# EasyEDA Pro project Project File.epro

# Schematic Schematic1
Board Name: Board1; Create Date: 2026-05-17; Page Name: P1; Project Name: USB--->TTL; Schematic Name: Schematic1; Update Date: 2026-05-17; Company: EasyEDA.com; Page Size: A4; Version: V1.0
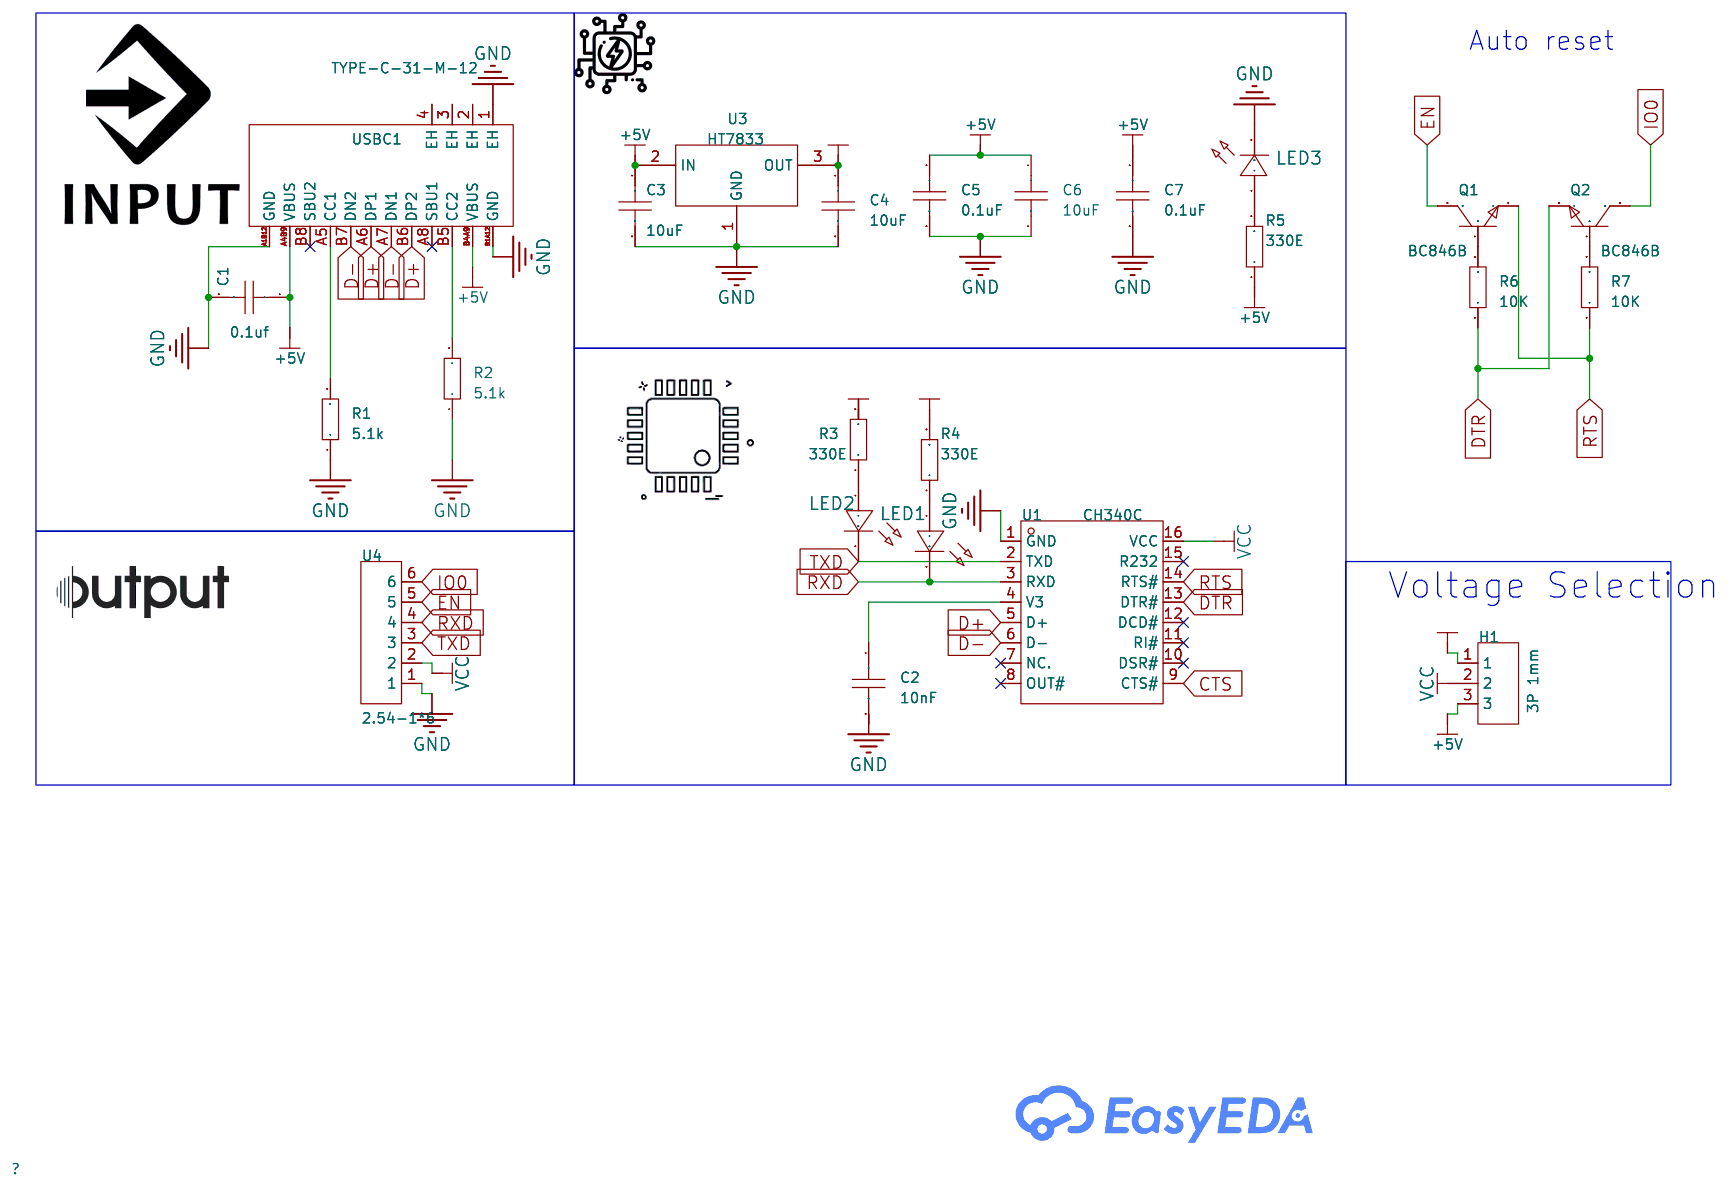
[diagram p0: schematic sheet]

## Parts
C1  0.1uf  [C0805]
C2  10nF  [C0805]
C3  10uF  [C0805]
C4  10uF  [C0805]
C5  0.1uF  [C0805]
C6  10uF  [C0805]
C7  0.1uF  [C0805]
H1  3P 1mm  [HDR-TH_3P-P1.00-V-M]
LED1  -  [LED0805-RD_GREEN_C0805YGC]
LED2  -  [LED0805-RD_GREEN_C0805YGC]
LED3  -  [LED0805-RD_GREEN_C0805YGC]
Q1  BC846B  [SOT-23-3_L2.9-W1.3-P1.90-LS2.4-BR]
Q2  BC846B  [SOT-23-3_L2.9-W1.3-P1.90-LS2.4-BR]
R1  5.1k  [R0805_NEW]
R2  5.1k  [R0805_NEW]
R3  330E  [R0805_NEW]
R4  330E  [R0805_NEW]
R5  330E  [R0805_NEW]
R6  10K  [R0805_NEW]
R7  10K  [R0805_NEW]
U1  CH340C  [SOP-16_L10.0-W3.9-P1.27-LS6.0-BL]
U3  HT7833  [SOT-89_L4.5-W2.5-P1.50-LS4.2-BR]
U4  2.54-1*6  [HDR-TH_6P-P2.54-V-M]
USBC1  TYPE-C-31-M-12  [USB-C_SMD-TYPE-C-31-M-12_1]

## Library data of the parts
C1-C7 = CAP_0603: Supplier Footprint: 0603
H1 = P2C03A-201020-B1P: Pin Structure:1x3P Pitch:1mm Row Spacing:- Circluar Pins/Square Pins:Pin Header Mounting Type:Through Hole Number of Rows:1 Number of Pins:3P Current Rating:750mA Voltage Rating (Max):125V Length of Mating Pin:2mm Insulation Height:1mm Length of End Conne; LCSC Part Name: 1x3P 间距:1mm 方针 直插; Supplier Part: C49005926; Manufacturer: CHIN-BAN(勤本); Supplier Footprint: 插件,P=1mm; JLCPCB Part Class: Extended Part; Datasheet: https://item.szlcsc.com/datasheet/P2C03A-201020-B1P/51356954.html; Supplier: LCSC; Pin Structure: 1x3P; Pitch: 1mm; Circluar Pins/Square Pins: Pin Header; Mounting Type: Through Hole; Number of Rows: 1; Number of Pins: 3P; Current Rating: 750mA; Voltage Rating (Max): 125V; Length of Mating Pin: 2mm; Insulation Height: 1mm; Length of End Connection Pin: 2mm; Contact Material: Copper alloy; Contact Plating: Gold; Operating Temperature: -40℃~+105℃; Color: Black
LED1-LED3 = LED_0402-R: Supplier Footprint: 0402
Q1 Q2 = BC846B_C20069134: type:NPN Current - Collector(Ic):100mA Collector - Emitter Voltage VCEO:65V Pd - Power Dissipation:200mW DC Current Gain:200@2.0mA,5.0V DC Current Gain:200@2.0mA,5.0V Transition frequency(fT):100MHz Current - Collector Cutoff:100nA Vce Saturation(VCE(sat); LCSC Part Name: hFE:200-450，丝印:1B NPN 电流:100mA 电压:65V; Supplier Part: C20069134; Manufacturer: R+O(宏嘉诚); Supplier Footprint: SOT-23; JLCPCB Part Class: Extended Part; Datasheet: https://item.szlcsc.com/datasheet/BC846B/21397172.html; Supplier: LCSC; type: NPN; Current - Collector(Ic): 100mA; Collector - Emitter Voltage VCEO: 65V; Pd - Power Dissipation: 200mW; DC Current Gain: 200@2.0mA,5.0V; Transition frequency(fT): 100MHz; Current - Collector Cutoff: 100nA; Vce Saturation(VCE(sat)): 500mV; Operating Temperature: -55℃~+150℃; Emitter-Base Voltage(Vebo): 6V
R1-R7 = Res_0603: Supplier Footprint: 0603
U1 = CH340C: Applications Function:Transceiver USB Protocol:USB 2.0 Voltage - Supply:3.3V；5V Voltage - Supply:3.3V；5V Data Rate:2Mbps Operating Temperature:-20℃~+70℃ Operating Temperature:-20℃~+70℃ Current - Supply:7mA Supply Current (Iq):50uA; LCSC Part Name: USB转串口芯片; Supplier Part: C84681; Manufacturer: WCH(南京沁恒); Supplier Footprint: SOP-16; JLCPCB Part Class: Extended Part; Datasheet: https://item.szlcsc.com/datasheet/CH340C/85852.html; Supplier: LCSC; Applications Function: Transceiver; USB Protocol: USB 2.0; Voltage - Supply: 3.3V；5V; Data Rate: 2Mbps; Operating Temperature: -20℃~+70℃; Current - Supply: 7mA; Supply Current (Iq): 50uA
U3 = HT7833_C50936: Output Type:Fixed Voltage - Supply:8V Output Voltage:3.3V Output Voltage:3.3V Output Current:500mA Power Supply Rejection Ratio (PSRR):- Voltage Dropout:500mV@(500mA) standby current:7uA Features:Over Current Protection；Over Temperature Protection Operati; LCSC Part Name: 输入8V 输出3.3V 500mA; Supplier Part: C50936; Manufacturer: HOLTEK(合泰/盛群); Supplier Footprint: SOT-89-3; JLCPCB Part Class: Extended Part; Supplier: LCSC; Output Type: Fixed; Voltage - Supply: 8V; Output Voltage: 3.3V; Output Current: 500mA; Voltage Dropout: 500mV@(500mA); standby current: 7uA; Features: Over Current Protection；Over Temperature Protection; Operating Temperature: -40℃~+85℃@(Ta); Output Configuration: Positive; Number of Outputs: 1
U4 = 2.54-1*6: Pin Structure:1x6P Pitch:2.54mm Circluar Pins/Square Pins:Pin Header Mounting Type:Through Hole Number of Rows:1 Number of Pins:6P Current Rating:2.5A Length of Mating Pin:6mm Insulation Height:2.54mm Length of End Connection Pin:3mm Contact Material:Bras; LCSC Part Name: 1x6P 间距:2.54mm 方针 直插; Supplier Part: C5156615; Manufacturer: ZHOURI(洲日); Supplier Footprint: 插件,P=2.54mm; JLCPCB Part Class: Extended Part; Datasheet: https://item.szlcsc.com/datasheet/2.54-1*6/5790715.html; Supplier: LCSC; Pin Structure: 1x6P; Pitch: 2.54mm; Circluar Pins/Square Pins: Pin Header; Mounting Type: Through Hole; Number of Rows: 1; Number of Pins: 6P; Current Rating: 2.5A; Length of Mating Pin: 6mm; Insulation Height: 2.54mm; Length of End Connection Pin: 3mm; Contact Material: Brass; Contact Plating: Gold; Operating Temperature: -40℃~+105℃
USBC1 = TYPE-C-31-M-12: Connector Type:Type-C Protocol Standard:- Gender:Female Mounting Type:Surface Mount, Right Angle Number of Contacts:16P Number of Ports:1 Current Rating-Power:5A Voltage Rating:20V Connect-Disconnect Life:10,000 cycles Length:7.35mm Operating Temperature:; LCSC Part Name: Type-C 母 卧贴; Supplier Part: C165948; Manufacturer: 韩国韩荣; Supplier Footprint: SMD; JLCPCB Part Class: Extended Part; Datasheet: https://item.szlcsc.com/datasheet/TYPE-C-31-M-12/177331.html; Supplier: LCSC; Connector Type: Type-C; Gender: Female; Mounting Type: Surface Mount, Right Angle; Number of Contacts: 16P; Number of Ports: 1; Current Rating-Power: 5A; Voltage Rating: 20V; Connect-Disconnect Life: 10,000 cycles; Length: 7.35mm; Operating Temperature: -30℃~+80℃

## Nets
3.3V: C4.1 H1.1 R3.2 R4.2 U3.3(OUT)
+5V: C1.1 C3.1 C5.1 C6.1 C7.1 H1.3 R5.1 U3.2(IN) USBC1.A4B9(VBUS) USBC1.B4A9(VBUS)
GND: C1.2 C2.2 C3.2 C4.2 C5.2 C6.2 C7.2 LED3.2(C) R1.1 R2.1 U1.1(GND) U3.1(GND) U4.1 USBC1.1(EH) USBC1.A1B12(GND) USBC1.B1A12(GND)
VCC: H1.2 U1.16(VCC) U4.2
CTS: U1.9(CTS#)
D+: U1.5(D+) USBC1.A6(DP1) USBC1.B6(DP2)
D-: U1.6(D-) USBC1.A7(DN1) USBC1.B7(DN2)
DTR: Q2.2(E) R6.1 U1.13(DTR#)
EN: Q1.3(C) U4.5
IO0: Q2.3(C) U4.6
RTS: Q1.2(E) R7.1 U1.14(RTS#)
RXD: LED1.2(C) U1.3(RXD) U4.4
TXD: LED2.2(C) U1.2(TXD) U4.3
$1N550: R1.2 USBC1.A5(CC1)
$1N1145: C2.1 U1.4(V3)
$1N1398: LED2.1(A) R3.1
$1N1424: LED1.1(A) R4.1
$1N1991: LED3.1(A) R5.2
$1N2444: Q1.1(B) R6.2
$1N2534: Q2.1(B) R7.2
$1N4404: R2.2 USBC1.B5(CC2)

Not connected (* = marked no-connect by the designer): U1 7(NC.)* 8(OUT#)* 10(DSR#)* 11(RI#)* 12(DCD#)* 15(R232)*; USBC1 2(EH) 3(EH) 4(EH) A8(SBU1)* B8(SBU2)*

## Notes on the sheet
- Auto reset
- Voltage Selection

# Board PCB1
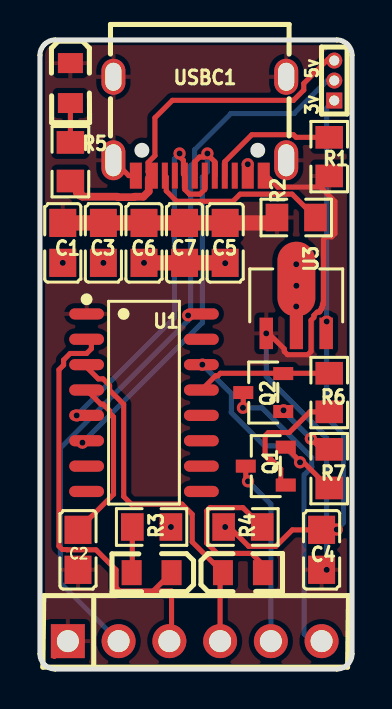
[diagram p1: board, top side]
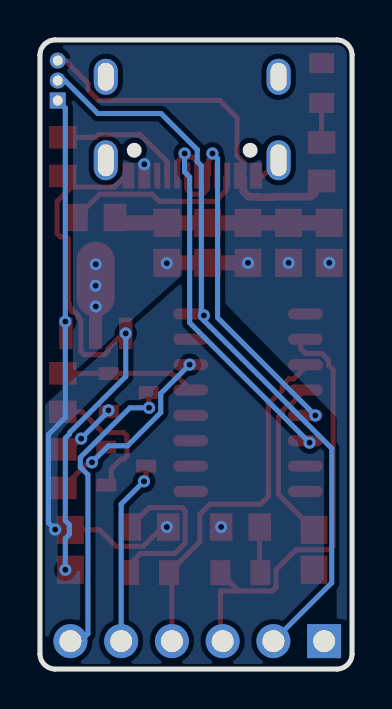
[diagram p2: board, bottom side, seen from below]

Outline 15.62 x 31.5 mm; copper layers: Top Layer, Bottom Layer. Coordinates in mm from the lower left corner of the outline.
Outline path: 0,30.73 0,0.76 arc(0.22,0.22) 0.76,0 14.86,0 arc(15.4,0.22) 15.62,0.76 15.62,30.73 arc(15.4,31.27) 14.86,31.5 0.76,31.5 arc(0.22,31.27) 0,30.73
Stack: Top Layer 0.035mm / Dielectric1 1.51mm FR4 er 4.5 / Bottom Layer 0.035mm

## Design rules (mm)
template: JLCPCB Capability(Two Layers Board)
spacing copperThickness1oz (default): track to track 0.102, other pairs 0.152 to 0.3
spacing copperThickness2oz: track to track 0.203, other pairs 0.152 to 0.3
track width copperThickness1oz (default): min 0.127, default 0.254, max 2.54
track width copperThickness2oz: min 0.203, default 0.254, max 2.54
differential pair differentialPair (default): width min 0.127, default 0.254, max 2.54; gap min 0.152, default 0.152
via viaSize (default): diameter min 0.5, default 0.61, max 10; hole min 0.3, default 0.305, max 6.3

## Placement (name value [footprint] x y rotation side)
3v  5v  -  [HDR-TH_3P-P1.00-V-M]  14.73 29.46 90 top
C1  0.1uf  [C0805]  1.14 21.34 90 top
C2  10nF  [C0805]  1.91 5.97 270 top
C3  10uF  [C0805]  3.18 21.34 90 top
C4  10uF  [C0805]  14.1 5.97 270 top
C5  0.1uF  [C0805]  9.27 21.34 90 top
C6  10uF  [C0805]  5.21 21.34 90 top
C7  0.1uF  [C0805]  7.24 21.34 90 top
LED1  -  [LED0805-RD_GREEN_C0805YGC]  10.16 4.83 0 top
LED2  -  [LED0805-RD_GREEN_C0805YGC]  5.59 4.83 180 top
LED3  -  [LED0805-RD_GREEN_C0805YGC]  1.52 29.34 270 top
Q1  BC846B  [SOT-23-3_L2.9-W1.3-P1.90-LS2.4-BR]  11.3 10.16 0 top
Q2  BC846B  [SOT-23-3_L2.9-W1.3-P1.90-LS2.4-BR]  11.18 13.84 0 top
R1  5.1k  [R0805_NEW]  14.48 25.65 90 top
R2  5.1k  [R0805_NEW]  12.83 22.61 0 top
R3  330E  [R0805_NEW]  5.59 7.11 0 top
R4  330E  [R0805_NEW]  10.16 7.11 180 top
R5  330E  [R0805_NEW]  1.52 25.4 90 top
R6  10K  [R0805_NEW]  14.48 13.84 270 top
R7  10K  [R0805_NEW]  14.48 10.03 90 top
U1  CH340C  [SOP-16_L10.0-W3.9-P1.27-LS6.0-BL]  5.21 13.34 270 top
U3  HT7833  [SOT-89_L4.5-W2.5-P1.50-LS4.2-BR]  12.83 18.16 270 top
U4  2.54-1*6  [HDR-TH_6P-P2.54-V-M]  7.75 1.4 0 top
USBC1  TYPE-C-31-M-12  [USB-C_SMD-TYPE-C-31-M-12_1]  8 27.18 180 top

## Footprints (pads in the part's own frame, mm; a bottom-side part is the same pattern mirrored in y, then rotated)
C0805
  rect 1.41x1.35 smd: 1(-1,0) 2(1,0)
HDR-TH_3P-P1.00-V-M
  rect 0.8x0.8 hole 0.5: 1(-1,0)
  round 0.8 hole 0.5: 2(0,0) 3(1,0)
HDR-TH_6P-P2.54-V-M
  rect 1.7x1.7 hole 1.1: 1(-6.35,0)
  round 1.7 hole 1.1: 2(-3.81,0) 3(-1.27,0) 4(1.27,0) 5(3.81,0) 6(6.35,0)
LED0805-RD_GREEN_C0805YGC
  rect 1x1.25 smd: 1(1,0) 2(-1,0)
R0805_NEW
  rect 1.133x1.377 smd: 1(-0.966,0) 2(0.966,0)
SOP-16_L10.0-W3.9-P1.27-LS6.0-BL
  oval 0.56x1.745 smd: 1(-4.445,-2.873) 2(-3.175,-2.873) 3(-1.905,-2.873) 4(-0.635,-2.873) 5(0.635,-2.873) 6(1.905,-2.873) 7(3.175,-2.873) 8(4.445,-2.873) 9(4.445,2.873) 10(3.175,2.873) 11(1.905,2.873) 12(0.635,2.873) 13(-0.635,2.873) 14(-1.905,2.873) 15(-3.175,2.873) 16(-4.445,2.873)
SOT-23-3_L2.9-W1.3-P1.90-LS2.4-BR
  rect 1x0.65 smd: 1(1,-0.95) 2(1,0.95) 3(-1,0)
SOT-89_L4.5-W2.5-P1.50-LS4.2-BR
  rect 1.575x0.672 smd: 1(1.356,-1.5) 3(1.356,1.5)
  custom 5.377x1.9 smd: 2(-1.356,0.009)
USB-C_SMD-TYPE-C-31-M-12_1
  oval 1.2x2 hole 0.8x1.6: 1(4.325,1.706) 4(-4.325,1.706)
  oval 1.2x1.8 hole 0.8x1.4: 2(4.325,-2.474) 3(-4.325,-2.474)
  custom 0.6x1.3 smd: A1B12(-3.2,2.474) A4B9(-2.4,2.474) B1A12(3.2,2.474) B4A9(2.401,2.474)
  rect 0.3x1.3 smd: A5(-1.25,2.474) A6(-0.25,2.474) A7(0.25,2.474) A8(1.25,2.474) B5(1.75,2.474) B6(0.75,2.474) B7(-0.75,2.474) B8(-1.75,2.474)

## Nets
As in the schematic, except:
3.3V: 3v  5v.1 C4.1 R3.2 R4.2 U3.3
+5V: 3v  5v.3 C1.1 C3.1 C5.1 C6.1 C7.1 R5.1 U3.2 USBC1.A4B9 USBC1.B4A9
GND: C1.2 C2.2 C3.2 C4.2 C5.2 C6.2 C7.2 LED3.2 R1.1 R2.1 U1.1 U3.1 U4.1 USBC1.1 USBC1.2 USBC1.3 USBC1.4 USBC1.A1B12 USBC1.B1A12
VCC: 3v  5v.2 U1.16 U4.2

Pads without a net: U1 7 8 10 11 12 15; USBC1 A8 B8

## Via types
v1: diameter 0.61, hole 0.305, Top Layer to Bottom Layer, 25 vias

## Routing (per net, layer and track width the routed paths; a pad name or vN(x,y) marks a point on that pad's centre or on a via; arc(x,y) is an arc through that point)
3.3V: length 29.2
  Top Layer w0.254: v1(9.27,7.11) R4.2 9.34,6.97 9.62,6.97 10.44,6.14 11.81,6.14 12.63,6.97 C4.1 14.11,6.98 v1(14.86,6.98) ; U3.3 14.33,17.38 v1(14.35,17.4)
  Bottom Layer w0.254: v1(14.86,6.98) 15.19,7.32 15.19,11.74 14.35,12.59 v1(14.35,17.4) 14.35,28.08 3v  5v.1
  vias: v1(6.55,7.11)
+5V: length 23.5
  Top Layer w0.254: USBC1.A4B9 v1(10.4,25.27) ; USBC1.B4A9 5.41,24.89 5.41,25.36 5.75,25.7 5.75,27.6 6.63,28.47 12.69,28.47 13.21,28.99 13.21,29.32 14.41,30.53 14.67,30.53 3v  5v.3 ; v1(9.27,20.32) 9.29,20.34 ; R5.1 1.52,24.24 1.91,23.86
  Top Layer w0.381: 2.01,23.76 2.12,23.65 3.88,23.65 3.9,23.62 4.7,23.62 4.73,23.65 5.18,23.65 5.44,23.91 5.44,24.55 USBC1.B4A9
  Top Layer w0.508: 2.01,23.76 1.91,23.86
  Top Layer w0.762: 9.29,20.34 C5.1 C7.1 v1(5.21,20.34)
  vias: v1(1.14,20.34) v1(3.18,20.34) v1(12.83,20.27) v1(12.84,19.19) v1(12.83,18.15)
GND: length 41.7
  Top Layer w0.254: USBC1.A1B12 11.33,24.7 11.9,24.13 14.04,24.13 14.77,23.41 14.77,21.8 14.6,21.64 14.31,21.64 14.19,21.52 14.19,18.39 14.19,18.39 14.19,18.35 14.18,18.34 14.18,18.3 14.18,18.3 14.18,18.26 14.17,18.25 14.17,18.22 14.15,18.21 14.15,18.18 14.14,18.17 14.14,18.14 14.13,18.13 14.13,18.1 14.11,18.09 14.11,18.06 14.09,18.05 14.09,18.03 14.07,18.01 14.07,17.99 14.05,17.97 14.05,17.95 14.02,17.93 14.02,17.92 13.99,17.89 13.99,17.89 13.98,17.87 13.88,17.87 13.71,17.71 13.71,17.6 13.57,17.46 13.57,15.9 13.41,15.74 12.39,15.74 12.23,15.9 12.23,16.03 11.45,16.81 v1(11.33,16.81) ; 3.68,25.47 4.44,24.7 USBC1.B1A12 ; 0.72,0.63 0.72,0.72 U4.1
  Top Layer w0.762: R2.1 11.59,22.34 C5.2 C7.2 C6.2 C3.2 C1.2
  Bottom Layer w0.254: v1(11.33,16.81) 11.33,14.65 14.14,11.83 14.14,11.77 14.35,11.56 14.35,7.43 14.15,7.23 14.15,6.74 14.35,6.54 v1(14.35,4.97)
VCC: length 37.7
  Top Layer w0.254: U1.16 8,17.7 v1(7.42,17.7)
  Bottom Layer w0.254: 3v  5v.2 14.37,29.46 12.72,27.81 9.56,27.81 7.75,26 7.75,25.4 7.54,25.2 7.54,17.84 7.49,17.79 7.49,17.78 v1(7.42,17.7) 7.42,17.45 1.02,11.05 1.02,4.32 U4.2
D+: length 19.5
  Top Layer w0.254: v1(6.99,25.81) 6.99,25.66 7.18,25.47 7.18,24.77 USBC1.B6 7.25,24.01 7.49,23.78 8.02,23.78 8.25,24.01 USBC1.A6 ; v1(1.84,12.7) 2.33,12.7 U1.5
  Bottom Layer w0.254: v1(6.99,25.81) 6.73,25.55 6.73,17.59 v1(1.84,12.7)
D-: length 20.1
  Top Layer w0.254: U1.6 2.24,11.33 v1(2.13,11.33) ; USBC1.A7 7.75,24.8 7.75,24.8 7.75,25.39 7.99,25.63 8.2,25.63 v1(8.38,25.81) 8.38,25.77 8.76,25.39 8.76,24.72 USBC1.B7
  Bottom Layer w0.254: v1(2.13,11.33) 8.13,17.34 8.13,24.63 8.38,24.88 v1(8.38,25.81)
DTR: length 6.7
  Top Layer w0.254: R6.1 9.03,14.81 8.9,14.68 8.79,14.68 U1.13
EN: length 9.3
  Top Layer w0.254: Q1.3 10.3,9.51 v1(10.41,9.4)
  Bottom Layer w0.254: U4.5 11.56,8.26 v1(10.41,9.4)
IO0: length 15.3
  Top Layer w0.254: Q2.3 10.18,13.1 v1(10.16,13.08)
  Bottom Layer w0.254: U4.6 13.59,1.4 13.22,1.77 13.22,9.73 13.6,10.11 13.6,10.59 11.11,13.08 v1(10.16,13.08)
RTS: length 10.5
  Top Layer w0.254: U1.14 v1(8.13,15.24) ; v1(13.02,10.35) 13.02,10.4 Q1.2 ; R7.1 13.11,10.44
  Bottom Layer w0.254: v1(13.02,10.35) 12.19,11.18 11.24,11.18 9.58,12.84 9.58,13.79 v1(8.13,15.24)
RXD: length 18.4
  Top Layer w0.254: U1.3 2.33,15.11 2.92,14.53 3.16,14.53 3.49,14.2 3.49,13.96 4.19,13.26 4.19,8.64 4.57,8.26 7.11,8.26 7.62,7.75 7.62,6.37 LED1.2 9.02,4.68 U4.4
TXD: length 22.6
  Top Layer w0.254: 5.67,3.91 6.59,3.91 6.59,1.51 U4.3 ; 5.67,3.91 3.99,3.91 3.81,4.09 3.81,4.97 2.81,5.97 1.35,5.97 1.34,5.98 1.11,5.98 0.95,6.15 0.95,14.99 1.18,15.22 1.18,15.47 1.51,15.8 2.33,15.8 2.57,16.04 2.57,16.4 2.46,16.51 U1.2 ; 5.67,3.91 LED2.2
$1N550: length 6.5
  Top Layer w0.254: USBC1.A5 9.25,25.4 10.6,26.75 12.69,26.75 12.82,26.62 R1.2
$1N1145: length 8.4
  Top Layer w0.254: C2.1 3.68,8.75 3.68,12.62 3.49,12.82 3.49,12.93 3.16,13.26 3.05,13.26 U1.4
$1N1398: length 2.3
  Top Layer w0.254: R3.1 4.62,4.86 LED2.1
$1N1424: length 8.5
  Top Layer w0.254: LED1.1 11.16,5.22 10.59,5.79 8.87,5.79 8.35,6.31 8.35,7.92 8.51,8.08 10.16,8.08 R4.1
$1N1991: length 2
  Top Layer w0.254: R5.2 LED3.1
$1N2444: length 6.7
  Top Layer w0.254: R6.2 13.51,12.88 12.48,11.84 11.43,11.84 11.27,11.68 11.27,10.67 11.43,10.51 11.56,10.51 12.05,10.02 12.05,9.46 Q1.1
$1N2534: length 3.2
  Top Layer w0.254: v1(13.56,11.54) 14.1,11 14.48,11 ; Q2.1 12.19,12.91 v1(12.19,12.95)
  Bottom Layer w0.254: v1(13.56,11.54) 12.19,12.9 v1(12.19,12.95)
$1N4404: length 9.1
  Top Layer w0.254: R2.2 12.62,23.78 10.02,23.78 9.66,23.42 6.84,23.42 6.32,23.94 6.32,24.63 USBC1.B5

## Copper pours and planes (outline as drawn; the poured copper is in the pictures)
3.3V on Bottom Layer: 1.03,0.16 1.03,12.5 8.11,19.73 15.37,13.24 15.48,9.49 15.63,0.26 15.36,-0.01
+5V on Bottom Layer: -0.13,30.35 -0.11,30.55 -0.06,30.77 0.04,30.98 0.17,31.17 0.33,31.33 0.52,31.46 0.72,31.55 0.94,31.61 1.14,31.62 14.22,31.62 14.42,31.61 14.64,31.55 14.85,31.46 15.04,31.33 15.2,31.17 15.33,30.98 15.42,30.77 15.48,30.55 15.49,30.35 15.49,1.4 15.48,1.2 15.42,0.98 15.33,0.77 15.2,0.58 15.04,0.42 14.85,0.29 14.64,0.2 14.42,0.14 14.22,0.13 1.14,0.13 0.94,0.14 0.72,0.2 0.52,0.29 0.33,0.42 0.17,0.58 0.04,0.77 -0.06,0.98 -0.11,1.2 -0.13,1.4
GND on Top Layer: 0,30.23 0.02,30.42 0.07,30.65 0.17,30.85 0.3,31.04 0.46,31.2 0.64,31.33 0.85,31.42 1.07,31.48 1.27,31.5 14.35,31.5 14.55,31.48 14.77,31.42 14.98,31.33 15.16,31.2 15.33,31.04 15.46,30.85 15.55,30.65 15.61,30.42 15.62,30.23 15.62,1.27 15.61,1.07 15.55,0.85 15.46,0.64 15.33,0.46 15.16,0.3 14.98,0.17 14.77,0.07 14.55,0.02 14.35,0 1.27,0 1.07,0.02 0.85,0.07 0.64,0.17 0.46,0.3 0.3,0.46 0.17,0.64 0.07,0.85 0.02,1.07 0,1.27
